# Altium schematic sheet POWER.SchDoc
size A4
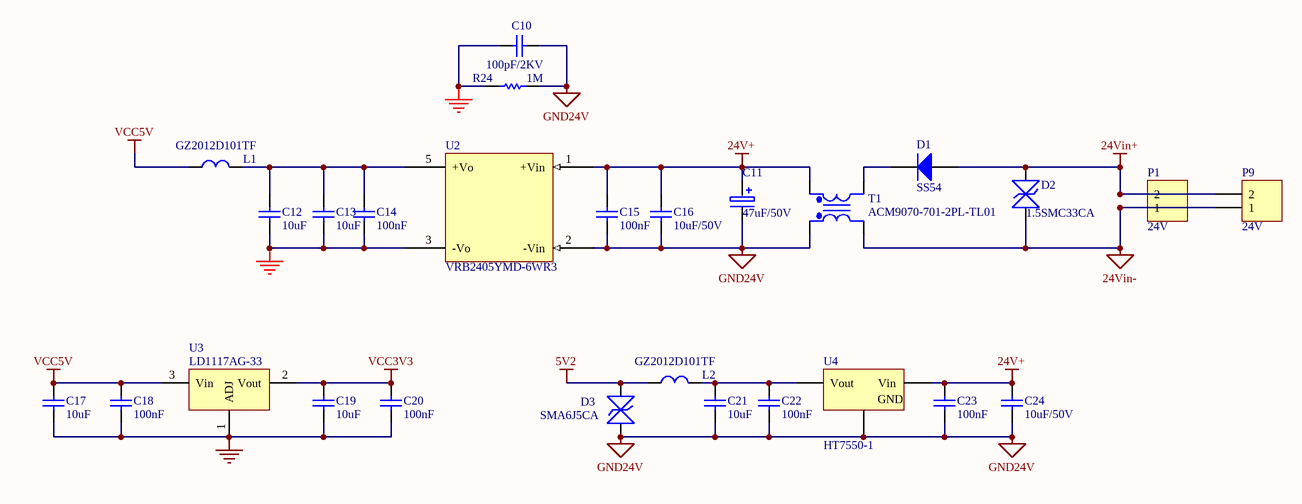
[diagram p0: POWER.SchDoc]

## Parts
C10  100pF/2KV  [1206_C]
C11  47uF/50V  [CD1/2]
C12  10uF  [0805_C]
C13  10uF  [0805_C]
C14  100nF  [0805_C]
C15  100nF  [0805_C]
C16  10uF/50V  [1206_C]
C17  10uF  [0805_C]
C18  100nF  [0805_C]
C19  10uF  [0805_C]
C20  100nF  [0805_C]
C21  10uF  [0805_C]
C22  100nF  [0805_C]
C23  100nF  [0805_C]
C24  10uF/50V  [1206_C]
D1  SS54  [SMA(DO-214AC)_S1]
D2  1.5SMC33CA  [SMC(DO-214AB)_S1]
D3  SMA6J5CA  [SMA]
L1  GZ2012D101TF  [0805_L]
L2  GZ2012D101TF  [0805_L]
P1  24V  [mc1.5/2-st-3.81]
P9  24V  [mc1.5/2-st-3.81]
R24  1M  [1206_R]
T1  ACM9070-701-2PL-TL01  [ACM1211]
U2  VRB2405YMD-6WR3  [DC/DC-1X1]
U3  LD1117AG-33  [SOT-223]
U4  HT7550-1  [SOT-89(SOT-89-3)]

## Nets
5V2: D3.1 L2.2
24V+: C11.1 C15.2 C16.2 C23.2 C24.2 T1.2(Pri+) U2.1(+Vin) U4.2(Vin)
24Vin+: D1.1(A) D2.2 P1.2 P9.2
24Vin-: D2.1 P1.1 P9.1 T1.4(Sec-)
GND: C10.1 C12.1 C13.1 C14.1 C17.1 C18.1 C19.1 C20.1 R24.1 U2.3(-Vo) U3.1(ADJ)
GND24V: C10.2 C11.2 C15.1 C16.1 C21.1 C22.1 C23.1 C24.1 D3.2 R24.2 T1.1(Sec+) U2.2(-Vin) U4.1(GND)
NC: U2.4(NC)
VCC3V3: C19.2 C20.2 U3.2(Vout)
VCC5V: C17.2 C18.2 L1.2 U3.3(Vin)
NetC12_2: C12.2 C13.2 C14.2 L1.1 U2.5(+Vo)
NetC21_2: C21.2 C22.2 L2.1 U4.3(Vout)
NetD1_2: D1.2(K) T1.3(Pri-)

## Library data of the parts
C10 = Cap: Capacitor; Value: 100nF; Published: 8-Jun-2000; LatestRevisionDate: 17-Jul-2002; LatestRevisionNote: Re-released for DXP Platform.; PackageReference: RAD-0.3; Publisher: Altium Limited
C11 = CD1: Electrolytic Capacitor; Text Field1: 4.7uF:4V-A;6.3V-A;10V-A;16V-BA;20V-BA;25V-CB;35V-DC;50V-D;; Text Field2: 10uF:4V-AB;6.3V-BA;10V-BA;16V-CBA;20V-CB;25V-DC;35V-D;; Text Field3: 22uF:4V-BA;6.3V-CBA;10V-CB;16V-DBC;20V-DC;25V-D;35V-D;; Text Field4: 33uF:4V-CAB;6.3V-CBA;10V-DBC;16V-DCB;20V-DC;25V-DE;; Text Field5: 47uF:4V-CBA;6.3V-DBC;10V-DBC;16V-DC;20V-DE;; Text Field6: 68uF:4V-DBC;6.3V-DCB;10V-DCB;16V-D;20V-DE;; Text Field7: 100uF:4V-DCB;6.3V-EDBC;10V-DC;16V-DE;20V-E;; Text Field8: 220uF:4V-EDC;6.3V-ED;10V-ED;
C12 C13 C17 C19 C21 = 0805 10uF (106) 10% 25V: 贴片电容; ComponentLink1Description: 供应商链接; ComponentLink1URL: http://www.szlcsc.com/product/details_16532.html; Package: 0805; Supplier: LC; SuppliersPartNumber: C15850
C14 C15 C18 C20 C22 C23 = 0805 100nF(104) 10% 50V: 贴片电容; ComponentLink1Description: 供应商链接; ComponentLink1URL: http://www.szlcsc.com/product/details_50686.html; Package: 0805; Supplier: LC; SuppliersPartNumber: C49678
C16 C24 = 1206 10uF (106) 10% 50V: 贴片电容; ComponentLink1Description: 供应商链接; ComponentLink1URL: http://www.szlcsc.com/product/details_14236.html; Package: 1206; Supplier: LC; SuppliersPartNumber: C13585
D1 = SMA(DO-214AC) SS54: 二极管; ComponentLink1Description: 供应商链接; ComponentLink1URL: http://www.szlcsc.com/product/details_23178.html; Package: SMA(DO-214AC); Supplier: LC; SuppliersPartNumber: C22452
D2 D3 = TVS
L1 L2 = L1
P1 P9 = Header 2: Header, 2-Pin; LatestRevisionDate: 17-Jul-2002; LatestRevisionNote: Re-released for DXP Platform.; Publisher: Altium Limited
R24 = Res1: Resistor; Value: 5.1K; Published: 8-Jun-2000; LatestRevisionDate: 17-Jul-2002; LatestRevisionNote: Re-released for DXP Platform.; PackageReference: AXIAL-0.3; Publisher: Altium Limited
T1 = ACP3225: TDP ACP3225 Common Mode Filters; Published: 8-Jun-2000; LatestRevisionDate: 17-Jul-2002; LatestRevisionNote: Re-released for DXP Platform.; PackageReference: TRF_4; Publisher: Altium Limited; PackageDescription: Transformer; 4 Leads
U2 = 48S5: Text Field1: 80; Text Field2: 80
U3 = LM1117: 3-Terminal Adjustable Positive Voltage Regulator
U4 = SOT-89 HT7550-1: 低压差线性稳压(LDO); ComponentLink1Description: 供应商链接; ComponentLink1URL: http://www.szlcsc.com/product/details_16788.html; Package: SOT-89; Supplier: LC; SuppliersPartNumber: C16106